# EAGLE design MotorAlarm2B (EAGLE 6.5.0)
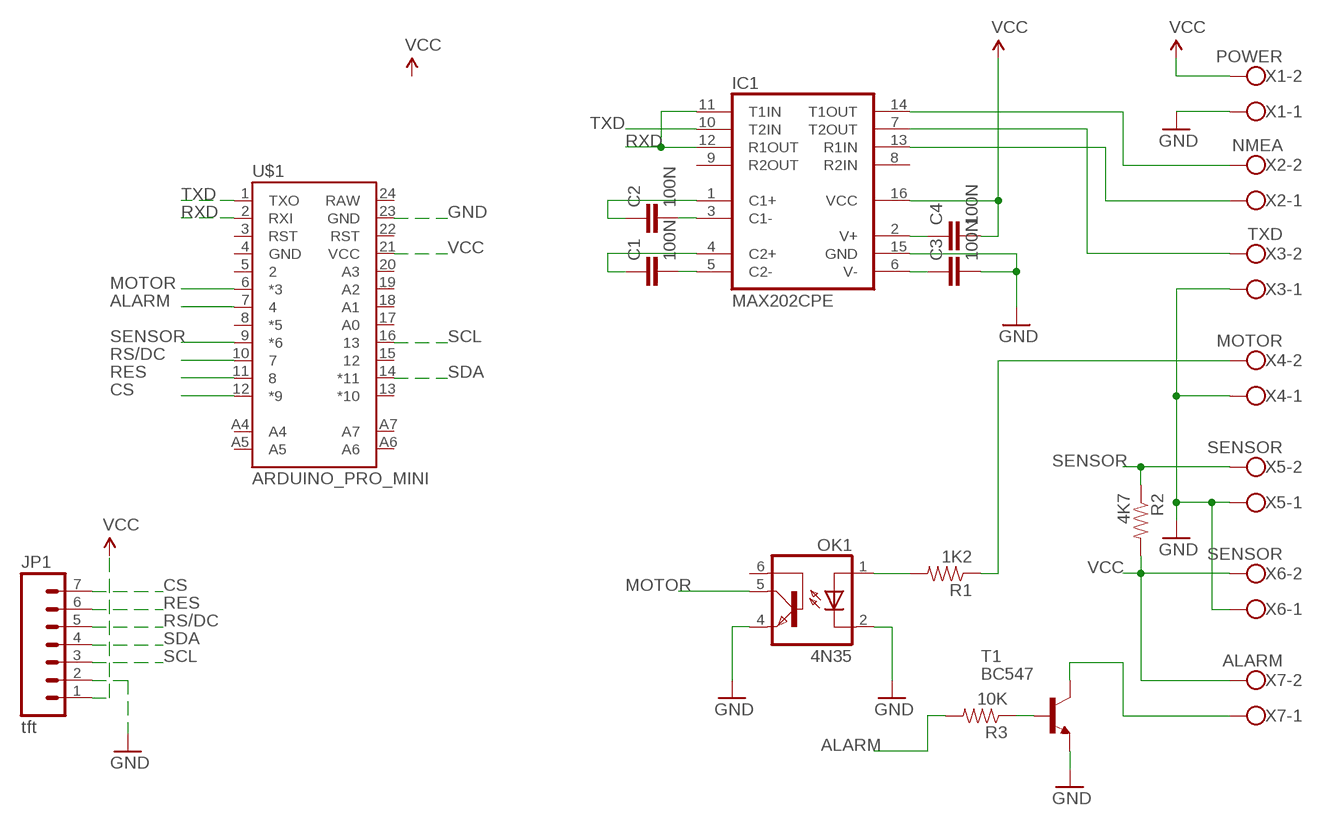
[diagram p0: schematic, sheet 1]

## Parts
C1  100N  CAPPTH  [CAP-PTH-SMALL]
C2  100N  CAPPTH  [CAP-PTH-SMALL]
C3  100N  CAPPTH  [CAP-PTH-SMALL]
C4  100N  CAPPTH  [CAP-PTH-SMALL]
IC1  MAX202CPE  [DIL16]
JP1  tft  M07  [1X07]
OK1  4N35  [DIL06]
R1  1K2  RESISTORPTH-1/4W  [AXIAL-0.4]
R2  4K7  RESISTORPTH-1/4W  [AXIAL-0.4]
R3  10K  RESISTORPTH-1/4W  [AXIAL-0.4]
T1  BC547  [TO92]
U$1  ARDUINO_PRO_MINI  [ARDUINO_PRO_MINI]
X1  POWER  W237-102  [W237-102]
X2  NMEA  W237-102  [W237-102]
X3  TXD  W237-102  [W237-102]
X4  MOTOR  W237-102  [W237-102]
X5  SENSOR  W237-102  [W237-102]
X6  SENSOR  W237-102  [W237-102]
X7  ALARM  W237-102  [W237-102]

## Nets
ALARM: R3.P$2 U$1.7
CS: JP1.7 U$1.12(*9)
GND: C3.2 IC1.15(GND) JP1.2 OK1.2(C) OK1.4(EMI) T1.1(E) U$1.23(GND) X1.1 X3.1 X4.1 X5.1 X6.1
MOTOR: OK1.5(COL) U$1.6(*3)
N$1: C1.2 IC1.5(C2-)
N$2: C1.1 IC1.4(C2+)
N$3: C2.2 IC1.3(C1-)
N$4: C2.1 IC1.1(C1+)
N$5: OK1.1(A) R1.P$2
N$6: IC1.14(T1OUT) X2.2
N$7: IC1.13(R1IN) X2.1
N$8: IC1.7(T2OUT) X3.2
N$9: R1.P$1 X4.2
N$10: T1.3(C) X7.1
N$11: R3.P$1 T1.2(B)
RES: JP1.6 U$1.11
RS/DC: JP1.5 U$1.10
RXD: IC1.11(T1IN) IC1.12(R1OUT) U$1.2(RXI)
SCL: JP1.3 U$1.16
SDA: JP1.4 U$1.14(*11)
SENSOR: R2.P$1 U$1.9(*6) X5.2
TXD: IC1.10(T2IN) U$1.1(TXO)
V+: C4.1 IC1.2(V+)
V-: C3.1 IC1.6(V-)
VCC: C4.2 IC1.16(VCC) JP1.1 R2.P$2 U$1.21(VCC) X1.2 X6.2 X7.2
Unconnected: IC1.8(R2IN) IC1.9(R2OUT) OK1.6(BAS) U$1.3(RST) U$1.4(GND) U$1.5 U$1.8(*5) U$1.13(*10) U$1.15 U$1.17(A0) U$1.18(A1) U$1.19(A2) U$1.20(A3) U$1.22(RST) U$1.24(RAW) U$1.A4 U$1.A5 U$1.A6 U$1.A7

## Library data of the parts
C1-C4 = SparkFun-Capacitors:CAP: Capacitor Standard 0603 ceramic capacitor, and 0.1" leaded capacitor.
IC1 = maxim:MAX202CPE: RS232 TRANSCEIVER; MF: MAXIM; MPN: MAX202CPE+; OC_FARNELL: 9723803; OC_NEWARK: 68K4531
JP1 = SparkFun-Connectors:M07: Header 7 Standard 7-pin 0.1" header. Use with straight break away headers (SKU : PRT-00116), right angle break away headers (PRT-00553), swiss pins (PRT-00743), machine pins (PRT-00117), and female headers (PRT-00115). NOTES ON THE VARIANTS LOCK and LOCK_LONGPADS... This footprint was designed to help hold the alignment of a through-hole component (i.e. 7-pin header) while soldering it into place. You may notice that each hole has been shifted either up or down by 0.005 of an inch from it's more standard position (which is usually a perfectly straight line). This slight alteration caused the pins (the squares in the middle) to touch the edges of the holes. Because they are alternating, it causes a "brace" to hold the header in place. 0.005 has proven to be the perfect amount of "off-center" position when using our standard breakaway headers. Although looks a little odd when you look at the bare footprint, once you have a header in there, the alteration is very hard to notice. Also, if you push a header all the way into place, it is covered up entirely on the bottom side. This idea of altering the position of holes to aid alignment will be further integrated into the Sparkfun Library for other footprints. It can help hold any component with 3 or more connection pins.
OK1 = optocoupler:4N35: MOTOROLA OPTO COUPLER; MF: FAIRCHILD SEMICONDUCTOR; MPN: 4N35; OC_FARNELL: 1328375; OC_NEWARK: 72K9946
R1-R3 = SparkFun-Passives:RESISTOR: Resistor Basic schematic elements and footprints for 0603, 1206, and PTH resistors.
T1 = transistor:BC547: NPN TRANSISTOR
U$1 = SparkFun-Boards:ARDUINO_PRO_MINI
X1-X7 = con-wago-500:W237-102: WAGO SCREW CLAMP; MPN: 237-102; OC_FARNELL: unknown; OC_NEWARK: 70K9898

## Board
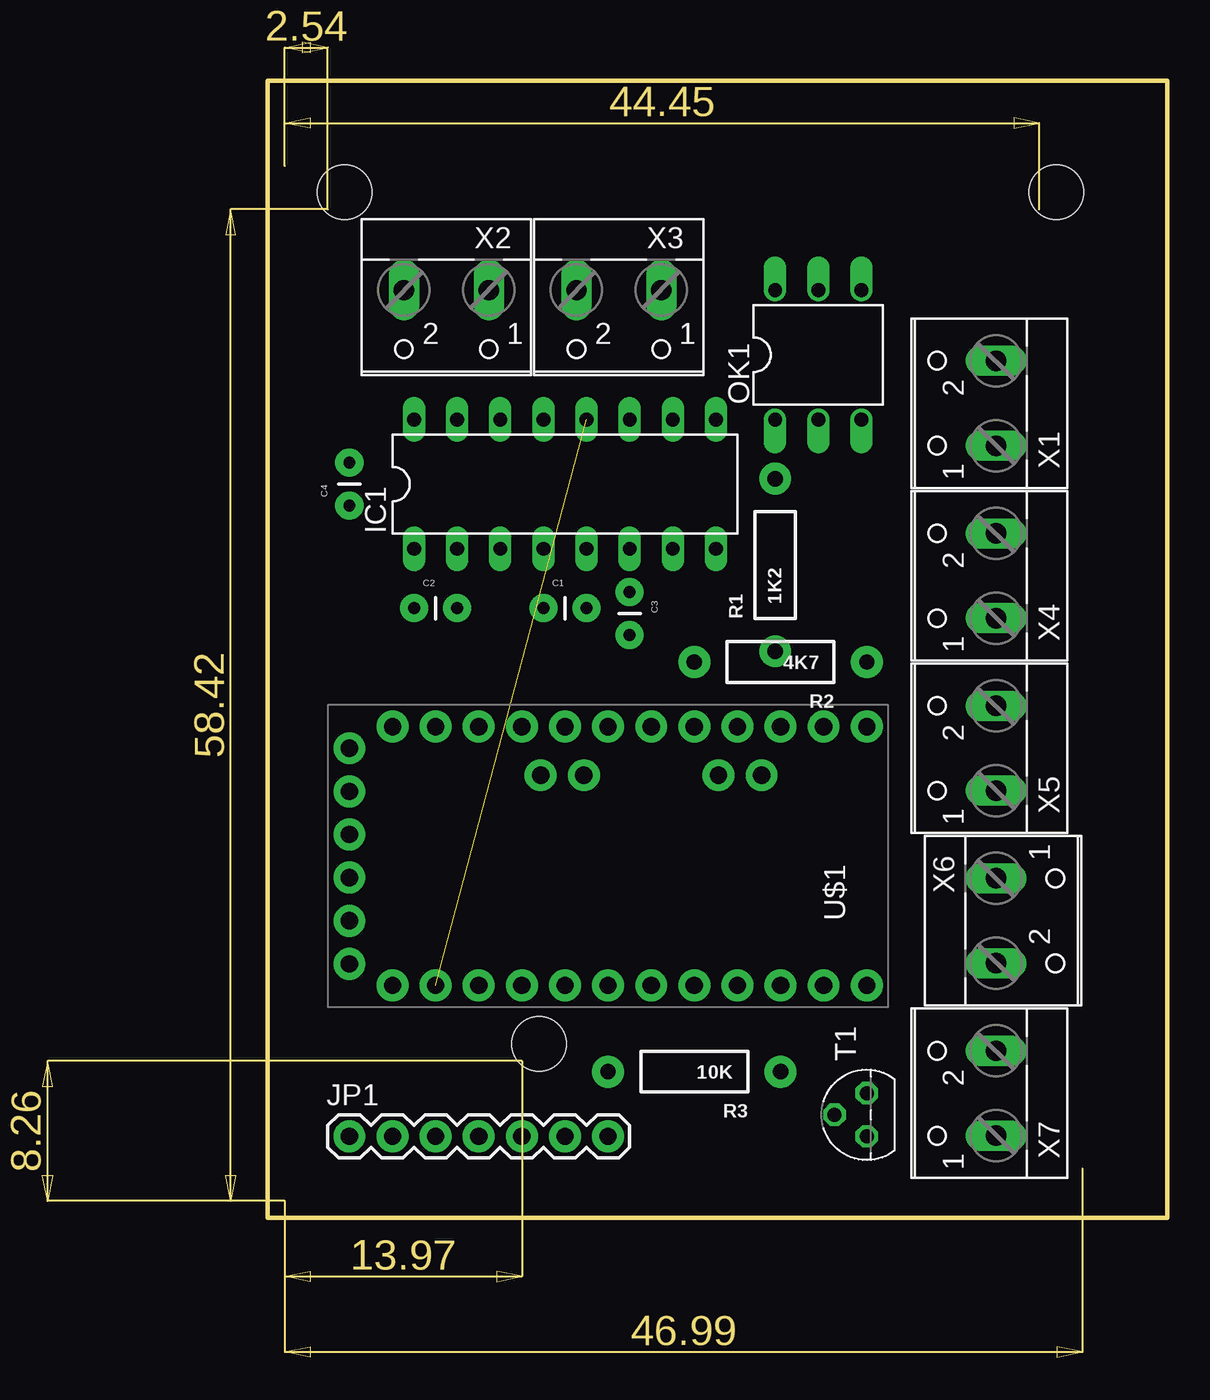
[diagram p1: board, top side]
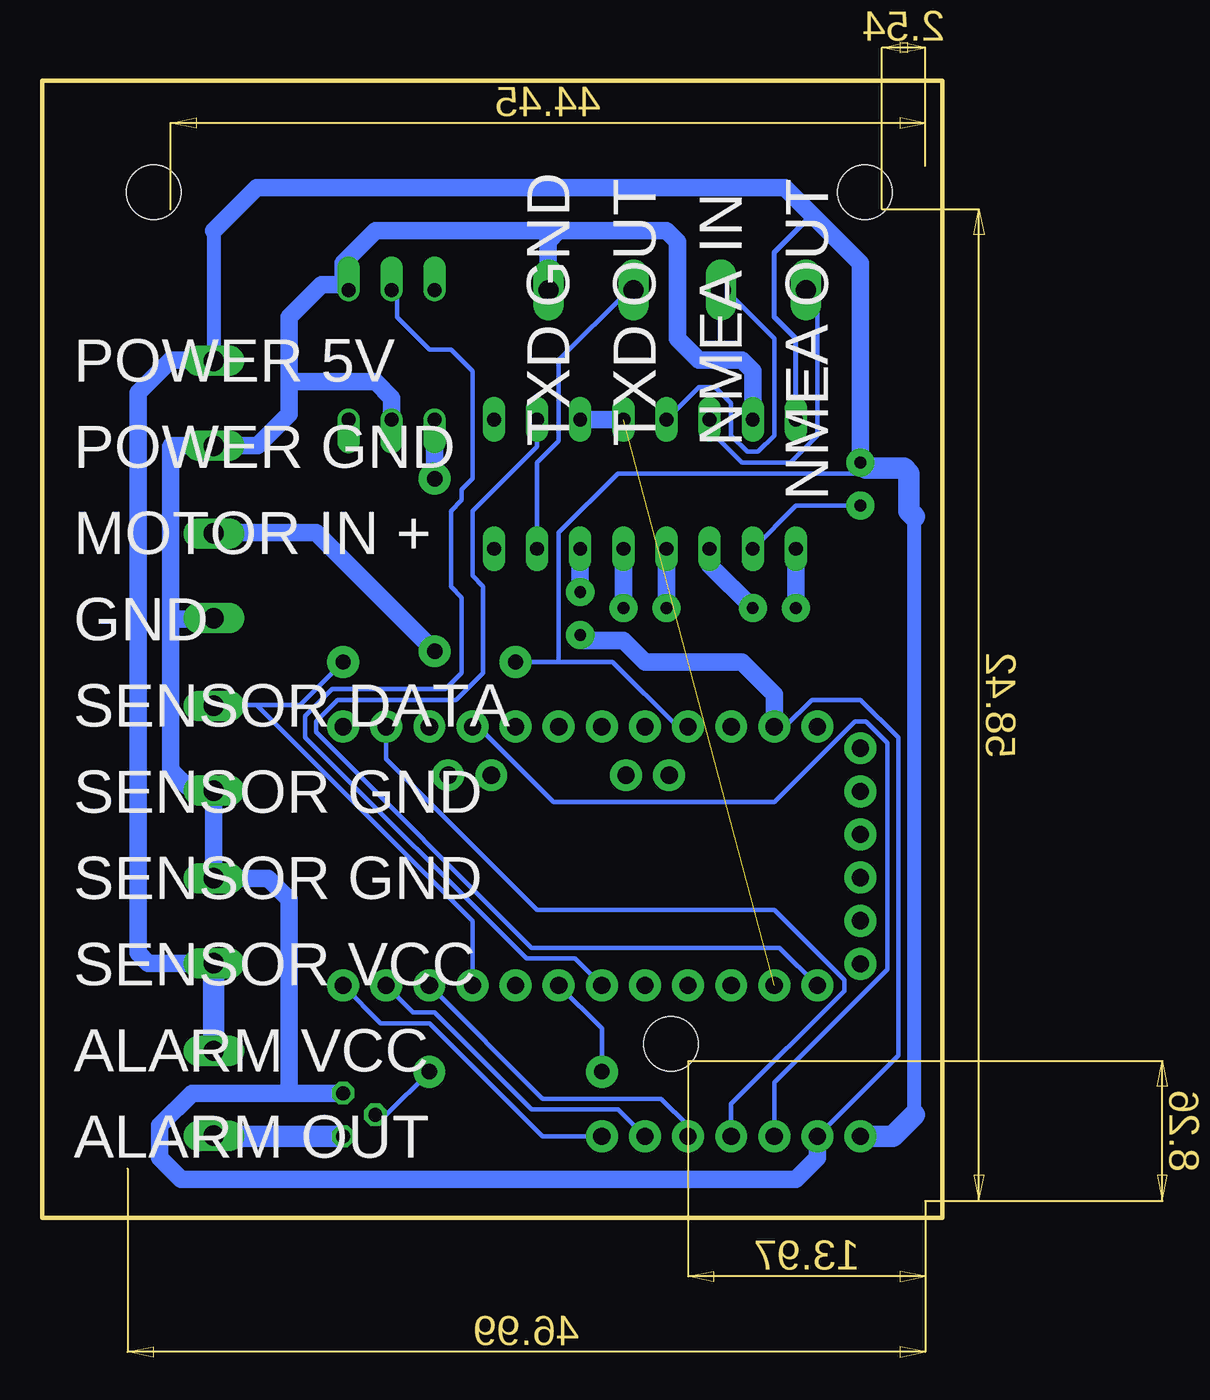
[diagram p2: board, bottom side, seen from below]

Size 53 x 67 mm. Coordinates in mm from the lower left corner, seen from the top.
Outline: 0,67 0,0 53,0 53,67 0,67
Copper layers (1*16): Top 0.035mm / dielectric 1.5mm / Bottom 0.035mm
Design rules "default *": minimum track width 10mil, minimum drill 24mil, track to track 8mil, track to pad 9mil, pad to pad 8mil, via to via 8mil, smd to smd 8mil, copper to edge 40mil, drill to drill 8mil, minimum pad ring 10mil, minimum via ring 8mil, stop-mask expansion 4mil, vias tented up to drill 0mil, thermal gap 10mil
Holes 3.2 mm at 4.54,60.42 46.45,60.42 15.97,10.26

### Footprints (pad centres in the part's own frame; a part is rotated, then mirrored left to right if it is on the bottom)
CAP-PTH-SMALL = drill 0.7 pad 1.651: 1 0,0; 2 2.54,0
DIL16 = drill 0.813 long: 1 -8.89,-3.81; 2 -6.35,-3.81; 3 -3.81,-3.81; 4 -1.27,-3.81; 5 1.27,-3.81; 6 3.81,-3.81; 7 6.35,-3.81; 8 8.89,-3.81; 9 8.89,3.81; 10 6.35,3.81; 11 3.81,3.81; 12 1.27,3.81; 13 -1.27,3.81; 14 -3.81,3.81; 15 -6.35,3.81; 16 -8.89,3.81
1X07 = drill 1.016 pad 1.88: 1 0,0; 2 2.54,0; 3 5.08,0; 4 7.62,0; 5 10.16,0; 6 12.7,0; 7 15.24,0
DIL06 = drill 0.813 offset: 1 -2.54,-3.81; 2 0,-3.81; 3 2.54,-3.81; 4 2.54,3.81; 5 0,3.81; 6 -2.54,3.81
AXIAL-0.4 = drill 0.9 pad 1.88: P$1 -5.08,0; P$2 5.08,0
TO92 = drill 0.813 octagon: 1 1.27,0; 2 0,1.905; 3 -1.27,0
ARDUINO_PRO_MINI = drill 1.016 pad 1.88: 1 -7.62,12.7; 2 -7.62,10.16; 3 -7.62,7.62; 4 -7.62,5.08; 5 -7.62,2.54; 6 -7.62,0; 7 -7.62,-2.54; 8 -7.62,-5.08; 9 -7.62,-7.62; 10 -7.62,-10.16; 11 -7.62,-12.7; 12 -7.62,-15.24; 13 7.62,-15.24; 14 7.62,-12.7; 15 7.62,-10.16; 16 7.62,-7.62; 17 7.62,-5.08; 18 7.62,-2.54; 19 7.62,0; 20 7.62,2.54; 21 7.62,5.08; 22 7.62,7.62; 23 7.62,10.16; 24 7.62,12.7; A4 4.763,1.429; A5 4.763,3.969; A6 4.763,-9.049; A7 4.763,-6.509; BLK -6.35,15.24; GND -3.81,15.24; GRN 6.35,15.24; RXI 1.27,15.24; TXO 3.81,15.24; VCC -1.27,15.24
W237-102 = drill 1.194 long: 1 -2.5,-1.27; 2 2.5,-1.27

### Placement (x,y rotation side)
C1  16.24,35.93 0 top
C2  8.62,35.93 0 top
C3  21.32,36.88 270 top
C4  4.81,41.96 90 top
IC1  17.51,43.23 0 top
JP1  4.81,4.81 0 top
OK1  32.43,50.85 0 top
R1  29.89,38.47 90 top
R2  30.21,32.75 180 top
R3  25.13,8.62 180 top
T1  35.29,6.08 90 top
U$1  20.05,21.32 90 top
X1  41.64,47.99 90 top
X2  10.53,53.39 180 top
X3  20.69,53.39 180 top
X4  41.64,37.83 90 top
X5  41.64,27.67 90 top
X6  44.18,17.51 270 top
X7  41.64,7.35 90 top

### Tracks (layer width: path | path; a pad name or v marks a point on that pad's centre or on a via)
ALARM
  Bottom 0.254: R3.P$2 20.05,11.16 U$1.7
CS
  Bottom 0.254: JP1.7 23.54,4.81 30.21,11.48 33.07,11.48 U$1.12
GND
  Bottom 0.254: 22.91,54.66 X3.1 | 42.91,25.45 X5.1 | U$1.23 9.26,28.94 7.67,30.53 4.81,30.53 2.59,28.3 2.59,9.57 JP1.2
  Bottom 1.016: JP1.2 7.35,3.54 8.62,2.27 44.82,2.27 46.09,3.54 46.09,5.45 44.18,7.35 38.47,7.35 | 38.47,7.35 T1.1 | 38.47,7.35 38.47,18.78 39.7,20.01 X6.1 X5.1 | 42.91,25.45 44.5,25.45 45.45,26.4 45.45,35.29 | 45.45,35.29 42.95,35.29 X4.1 | 45.45,35.29 45.45,45.45 45.41,45.49 X1.1 40.33,45.49 38.47,47.36 38.47,49.26 | U$1.23 9.89,30.84 11.79,32.75 17.51,32.75 18.78,34.02 21,34.02 C3.2 | IC1.15 11.16,49.9 11.79,50.53 14.33,50.53 15.6,51.8 15.6,57.52 16.24,58.15 22.59,58.15 23.23,57.52 | 23.23,57.52 23.23,54.7 X3.1 | 38.47,49.26 38.47,53.07 36.56,54.98 35.29,54.98 | OK1.2 32.43,48.31 33.39,49.26 38.47,49.26 | 23.23,57.52 23.23,58.15 33.39,58.15 35.29,56.25 35.29,54.98 | 35.29,54.98 OK1.4
MOTOR
  Bottom 0.254: U$1.6 21.64,15.29 24.49,15.29 37.51,28.3 37.51,29.58 35.93,31.16 29.26,31.16 28.3,32.12 28.3,36.56 28.94,37.2 28.94,41.64 28.3,42.27 28.3,42.91 27.67,43.55 27.67,49.9 28.94,51.16 30.21,51.16 32.12,53.07 32.12,54.34 OK1.5
N$1
  Bottom 1.016: IC1.5 C1.2
N$2
  Bottom 1.016: IC1.4 C1.1
N$3
  Bottom 0.254: 13.7,38.47 IC1.3
  Bottom 1.016: C2.2 13.7,38.47
N$4
  Bottom 1.016: IC1.1 C2.1
N$5
  Bottom 1.016: OK1.1 R1.P$2
N$6
  Bottom 0.254: IC1.14 13.7,46.4 11.79,44.5 8.94,44.5 7.35,46.09 7.35,54.02 7.98,54.66 X2.2
N$7
  Bottom 0.254: IC1.13 14.33,48.94 13.38,48.94 12.43,47.99 12.43,46.09 11.48,45.13 10.84,45.13 9.89,46.09 9.89,51.8 12.75,54.66 X2.1
N$8
  Bottom 0.254: IC1.7 23.86,44.5 22.59,45.77 22.59,50.53 18.46,54.66 X3.2
N$9
  Bottom 1.016: X4.2 42.87,40.37 36.88,40.37 R1.P$1
N$10
  Bottom 0.254: 42.91,4.81 X7.1
  Bottom 1.27: T1.3 42.87,4.81 X7.1
N$11
  Bottom 0.254: T1.2 32.75,6.08 R3.P$1
RES
  Bottom 0.254: U$1.11 31.16,12.11 29.89,12.11 24.18,6.4 19.1,6.4 JP1.6
RS/DC
  Bottom 0.254: U$1.10 23.54,7.03 16.56,7.03 14.97,5.45 JP1.5
RXD  (1 unrouted)
  Bottom 1.016: IC1.11 IC1.12
SCL
  Bottom 0.254: JP1.3 9.89,7.98 3.22,14.65 3.22,27.99 4.49,29.26 5.13,29.26 9.89,24.49 22.91,24.49 27.35,28.94 U$1.16
SDA
  Bottom 0.254: JP1.4 12.43,6.71 5.76,13.38 5.76,14.02 9.89,18.15 23.86,18.15 32.75,27.03 U$1.14 32.75,27.67
SENSOR
  Bottom 0.254: 40.37,30.21 37.83,30.21 R2.P$1 | 40.37,30.21 42.91,30.21 X5.2 | U$1.9 27.67,17.51 40.37,30.21
TXD
  Bottom 0.254: IC1.10 23.86,45.45 27.67,41.64 27.67,37.83 27.03,37.2 27.03,32.12 28.62,30.53 35.61,30.53 36.88,29.26 36.88,28.62 24.18,15.92 9.57,15.92 U$1.1
V+
  Bottom 0.254: IC1.2 8.62,41.96 C4.1
V-
  Bottom 1.016: C3.1 IC1.6
VCC
  Bottom 0.254: U$1.21 15.6,28.94 19.41,32.75 22.59,32.75 | R2.P$2 22.59,32.75 | C4.2 4.18,43.86 19.1,43.86 22.59,40.37 22.59,32.75
  Bottom 0.305: IC1.16 8.62,51.8 9.89,53.07 9.89,56.88 7.67,59.1
  Bottom 0.813: 1.63,6.08 1.63,41.32 | 42.91,58.15 X1.2
  Bottom 1.016: X6.2 46.76,15.01 47.36,15.6 47.36,48.62 45.45,50.53 42.95,50.53 X1.2 | C4.2 4.81,56.25 7.67,59.1 9.26,60.69 40.37,60.69 42.91,58.15
  Bottom 1.27: X7.2 X6.2 | JP1.1 2.91,4.81 1.63,6.08 | 1.63,41.32 1.95,41.64 1.95,43.86 2.27,44.18 4.49,44.18 C4.2

### Text on the board
bNames: POWER 5V | NMEA IN | TXD OUT | TXD GND | POWER GND | NMEA OUT | MOTOR IN + | GND | SENSOR DATA | SENSOR GND | SENSOR GND | SENSOR VCC | ALARM VCC | ALARM OUT